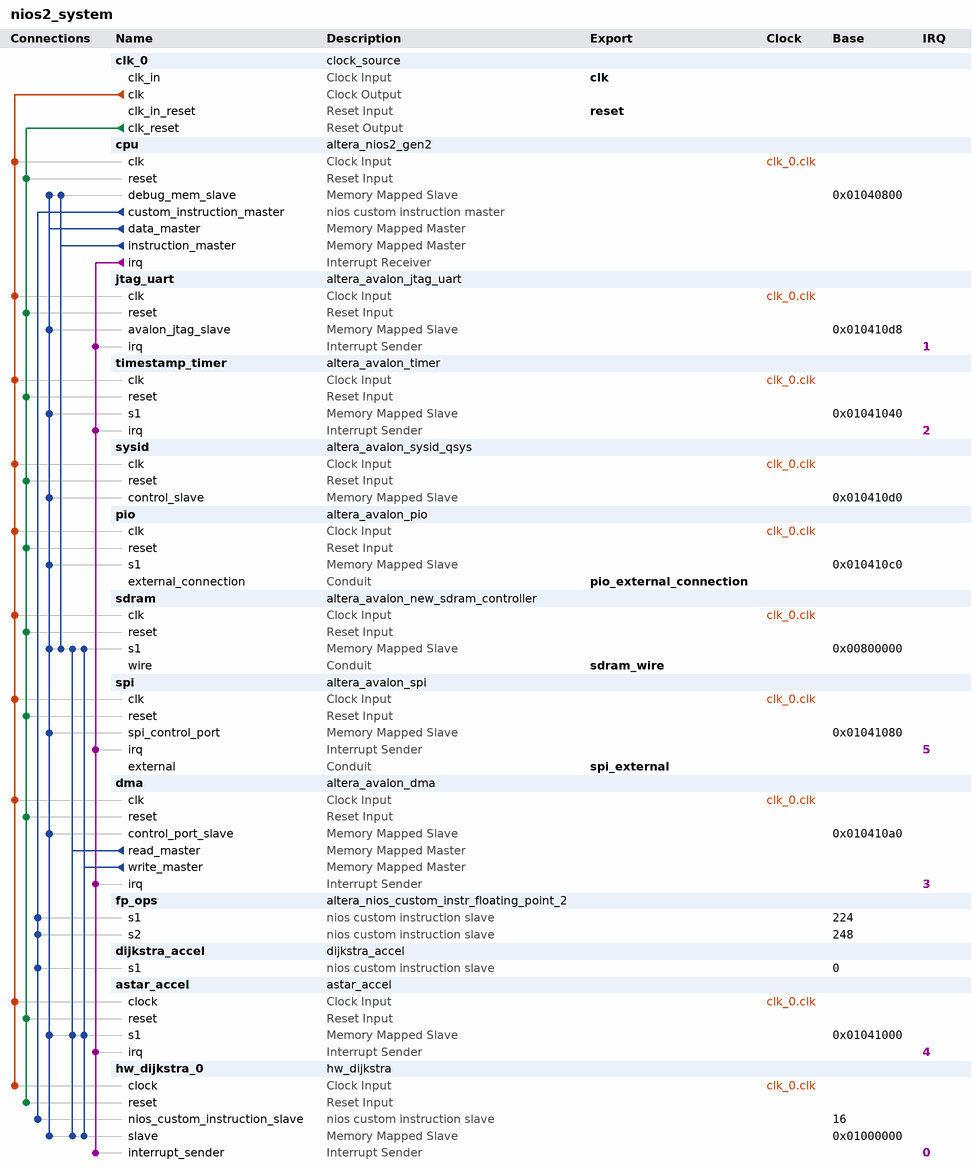
[diagram p0: system contents]
# Platform Designer (Qsys) system nios2_system, Cyclone V 5CSEMA5F31C6
# Parameters at their usual value, and those the tool derives, are not listed.
package require -exact qsys 20.1
create_system nios2_system
set_project_property DEVICE_FAMILY {Cyclone V}
set_project_property DEVICE 5CSEMA5F31C6

add_instance clk_0 clock_source 20.1
set_instance_parameter_value clk_0 clockFrequency 50000000

add_instance cpu altera_nios2_gen2 20.1
set_instance_parameter_value cpu dcache_size 16384
set_instance_parameter_value cpu exceptionSlave sdram.s1
set_instance_parameter_value cpu icache_size 16384
set_instance_parameter_value cpu impl Fast
set_instance_parameter_value cpu mul_32_impl 0
set_instance_parameter_value cpu mul_shift_choice 1
set_instance_parameter_value cpu resetSlave sdram.s1

add_instance jtag_uart altera_avalon_jtag_uart 20.1
set_instance_parameter_value jtag_uart simInteractiveOptions NO_INTERACTIVE_WINDOWS

add_instance timestamp_timer altera_avalon_timer 20.1
set_instance_parameter_value timestamp_timer counterSize 64
set_instance_parameter_value timestamp_timer period 0xFFFFFFFF
set_instance_parameter_value timestamp_timer periodUnits CLOCKS

add_instance sysid altera_avalon_sysid_qsys 20.1
set_instance_parameter_value sysid id 472386024

add_instance pio altera_avalon_pio 20.1
set_instance_parameter_value pio direction Output
set_instance_parameter_value pio width 8

add_instance sdram altera_avalon_new_sdram_controller 20.1
set_instance_parameter_value sdram TAC 5.5
set_instance_parameter_value sdram TRCD 20.0
set_instance_parameter_value sdram TRP 20.0
set_instance_parameter_value sdram casLatency 3
set_instance_parameter_value sdram columnWidth 8
set_instance_parameter_value sdram dataWidth 16
set_instance_parameter_value sdram generateSimulationModel true
set_instance_parameter_value sdram model single_Micron_MT48LC4M32B2_7_chip
set_instance_parameter_value sdram numberOfBanks 4
set_instance_parameter_value sdram numberOfChipSelects 1
set_instance_parameter_value sdram powerUpDelay 100.0
set_instance_parameter_value sdram refreshPeriod 15.625
set_instance_parameter_value sdram rowWidth 12

add_instance spi altera_avalon_spi 20.1
set_instance_parameter_value spi clockPolarity 0
set_instance_parameter_value spi dataWidth 32
set_instance_parameter_value spi insertSync true
set_instance_parameter_value spi masterSPI false
set_instance_parameter_value spi numberOfSlaves 1
set_instance_parameter_value spi targetClockRate 5000000

add_instance dma altera_avalon_dma 20.1
set_instance_parameter_value dma allowByteTransactions true
set_instance_parameter_value dma allowDoubleWordTransactions true
set_instance_parameter_value dma allowHalfWordTransactions true
set_instance_parameter_value dma allowQuadWordTransactions true
set_instance_parameter_value dma burstEnable false
set_instance_parameter_value dma fifoDepth 32
set_instance_parameter_value dma maxBurstSize 128
set_instance_parameter_value dma minimumDmaTransactionRegisterWidth 13

add_instance fp_ops altera_nios_custom_instr_floating_point_2 20.1
set_instance_parameter_value fp_ops arithmetic_present true
set_instance_parameter_value fp_ops comparison_present true
set_instance_parameter_value fp_ops conversion_present false
set_instance_parameter_value fp_ops root_present false

add_instance dijkstra_accel dijkstra_accel 1.2

add_instance astar_accel astar_accel 1.1
set_instance_parameter_value astar_accel ADDRESS_WIDTH 4
set_instance_parameter_value astar_accel VECTOR_SIZE 2

add_instance hw_dijkstra_0 hw_dijkstra 1.1
set_instance_parameter_value hw_dijkstra_0 INDEX_WIDTH 7
set_instance_parameter_value hw_dijkstra_0 MAX_NODES 128
set_instance_parameter_value hw_dijkstra_0 VALUE_WIDTH 32

# connections
add_connection clk_0.clk astar_accel.clock clock
add_connection clk_0.clk cpu.clk clock
add_connection clk_0.clk dma.clk clock
add_connection clk_0.clk hw_dijkstra_0.clock clock
add_connection clk_0.clk jtag_uart.clk clock
add_connection clk_0.clk pio.clk clock
add_connection clk_0.clk sdram.clk clock
add_connection clk_0.clk spi.clk clock
add_connection clk_0.clk sysid.clk clock
add_connection clk_0.clk timestamp_timer.clk clock
add_connection clk_0.clk_reset astar_accel.reset reset
add_connection clk_0.clk_reset cpu.reset reset
add_connection clk_0.clk_reset dma.reset reset
add_connection clk_0.clk_reset hw_dijkstra_0.reset reset
add_connection clk_0.clk_reset jtag_uart.reset reset
add_connection clk_0.clk_reset pio.reset reset
add_connection clk_0.clk_reset sdram.reset reset
add_connection clk_0.clk_reset spi.reset reset
add_connection clk_0.clk_reset sysid.reset reset
add_connection clk_0.clk_reset timestamp_timer.reset reset
add_connection cpu.data_master astar_accel.s1 avalon
set_connection_parameter_value cpu.data_master/astar_accel.s1 baseAddress 0x01041000
add_connection cpu.data_master cpu.debug_mem_slave avalon
set_connection_parameter_value cpu.data_master/cpu.debug_mem_slave baseAddress 0x01040800
add_connection cpu.data_master dma.control_port_slave avalon
set_connection_parameter_value cpu.data_master/dma.control_port_slave baseAddress 0x010410a0
add_connection cpu.data_master hw_dijkstra_0.slave avalon
set_connection_parameter_value cpu.data_master/hw_dijkstra_0.slave baseAddress 0x01000000
add_connection cpu.data_master jtag_uart.avalon_jtag_slave avalon
set_connection_parameter_value cpu.data_master/jtag_uart.avalon_jtag_slave baseAddress 0x010410d8
add_connection cpu.data_master pio.s1 avalon
set_connection_parameter_value cpu.data_master/pio.s1 baseAddress 0x010410c0
add_connection cpu.data_master sdram.s1 avalon
set_connection_parameter_value cpu.data_master/sdram.s1 baseAddress 0x00800000
add_connection cpu.data_master spi.spi_control_port avalon
set_connection_parameter_value cpu.data_master/spi.spi_control_port baseAddress 0x01041080
add_connection cpu.data_master sysid.control_slave avalon
set_connection_parameter_value cpu.data_master/sysid.control_slave baseAddress 0x010410d0
add_connection cpu.data_master timestamp_timer.s1 avalon
set_connection_parameter_value cpu.data_master/timestamp_timer.s1 baseAddress 0x01041040
add_connection cpu.instruction_master cpu.debug_mem_slave avalon
set_connection_parameter_value cpu.instruction_master/cpu.debug_mem_slave baseAddress 0x01040800
add_connection cpu.instruction_master sdram.s1 avalon
set_connection_parameter_value cpu.instruction_master/sdram.s1 baseAddress 0x00800000
add_connection dma.read_master astar_accel.s1 avalon
set_connection_parameter_value dma.read_master/astar_accel.s1 baseAddress 0x01041000
add_connection dma.read_master hw_dijkstra_0.slave avalon
set_connection_parameter_value dma.read_master/hw_dijkstra_0.slave baseAddress 0x01000000
add_connection dma.read_master sdram.s1 avalon
set_connection_parameter_value dma.read_master/sdram.s1 baseAddress 0x00800000
add_connection dma.write_master astar_accel.s1 avalon
set_connection_parameter_value dma.write_master/astar_accel.s1 baseAddress 0x01041000
add_connection dma.write_master hw_dijkstra_0.slave avalon
set_connection_parameter_value dma.write_master/hw_dijkstra_0.slave baseAddress 0x01000000
add_connection dma.write_master sdram.s1 avalon
set_connection_parameter_value dma.write_master/sdram.s1 baseAddress 0x00800000
add_connection cpu.irq astar_accel.irq interrupt
set_connection_parameter_value cpu.irq/astar_accel.irq irqNumber 4
add_connection cpu.irq dma.irq interrupt
set_connection_parameter_value cpu.irq/dma.irq irqNumber 3
add_connection cpu.irq hw_dijkstra_0.interrupt_sender interrupt
set_connection_parameter_value cpu.irq/hw_dijkstra_0.interrupt_sender irqNumber 0
add_connection cpu.irq jtag_uart.irq interrupt
set_connection_parameter_value cpu.irq/jtag_uart.irq irqNumber 1
add_connection cpu.irq spi.irq interrupt
set_connection_parameter_value cpu.irq/spi.irq irqNumber 5
add_connection cpu.irq timestamp_timer.irq interrupt
set_connection_parameter_value cpu.irq/timestamp_timer.irq irqNumber 2
add_connection cpu.custom_instruction_master dijkstra_accel.s1 nios_custom_instruction
set_connection_parameter_value cpu.custom_instruction_master/dijkstra_accel.s1 CIName dijkstra_accel_0
set_connection_parameter_value cpu.custom_instruction_master/dijkstra_accel.s1 baseAddress 0
add_connection cpu.custom_instruction_master fp_ops.s1 nios_custom_instruction
set_connection_parameter_value cpu.custom_instruction_master/fp_ops.s1 CIName nios_custom_instr_floating_point_2_0
set_connection_parameter_value cpu.custom_instruction_master/fp_ops.s1 baseAddress 224
add_connection cpu.custom_instruction_master fp_ops.s2 nios_custom_instruction
set_connection_parameter_value cpu.custom_instruction_master/fp_ops.s2 CIName nios_custom_instr_floating_point_2_0_1
set_connection_parameter_value cpu.custom_instruction_master/fp_ops.s2 baseAddress 248
add_connection cpu.custom_instruction_master hw_dijkstra_0.nios_custom_instruction_slave nios_custom_instruction
set_connection_parameter_value cpu.custom_instruction_master/hw_dijkstra_0.nios_custom_instruction_slave CIName hw_dijkstra_0
set_connection_parameter_value cpu.custom_instruction_master/hw_dijkstra_0.nios_custom_instruction_slave baseAddress 16

# exported interfaces
add_interface clk clock sink
set_interface_property clk EXPORT_OF clk_0.clk_in
add_interface pio_external_connection conduit end
set_interface_property pio_external_connection EXPORT_OF pio.external_connection
add_interface reset reset sink
set_interface_property reset EXPORT_OF clk_0.clk_in_reset
add_interface sdram_wire conduit end
set_interface_property sdram_wire EXPORT_OF sdram.wire
add_interface spi_external conduit end
set_interface_property spi_external EXPORT_OF spi.external

set_interconnect_requirement {$system} qsys_mm.clockCrossingAdapter HANDSHAKE
set_interconnect_requirement {$system} qsys_mm.enableEccProtection FALSE
set_interconnect_requirement {$system} qsys_mm.insertDefaultSlave FALSE
set_interconnect_requirement {$system} qsys_mm.maxAdditionalLatency 1

save_system nios2_system.qsys
